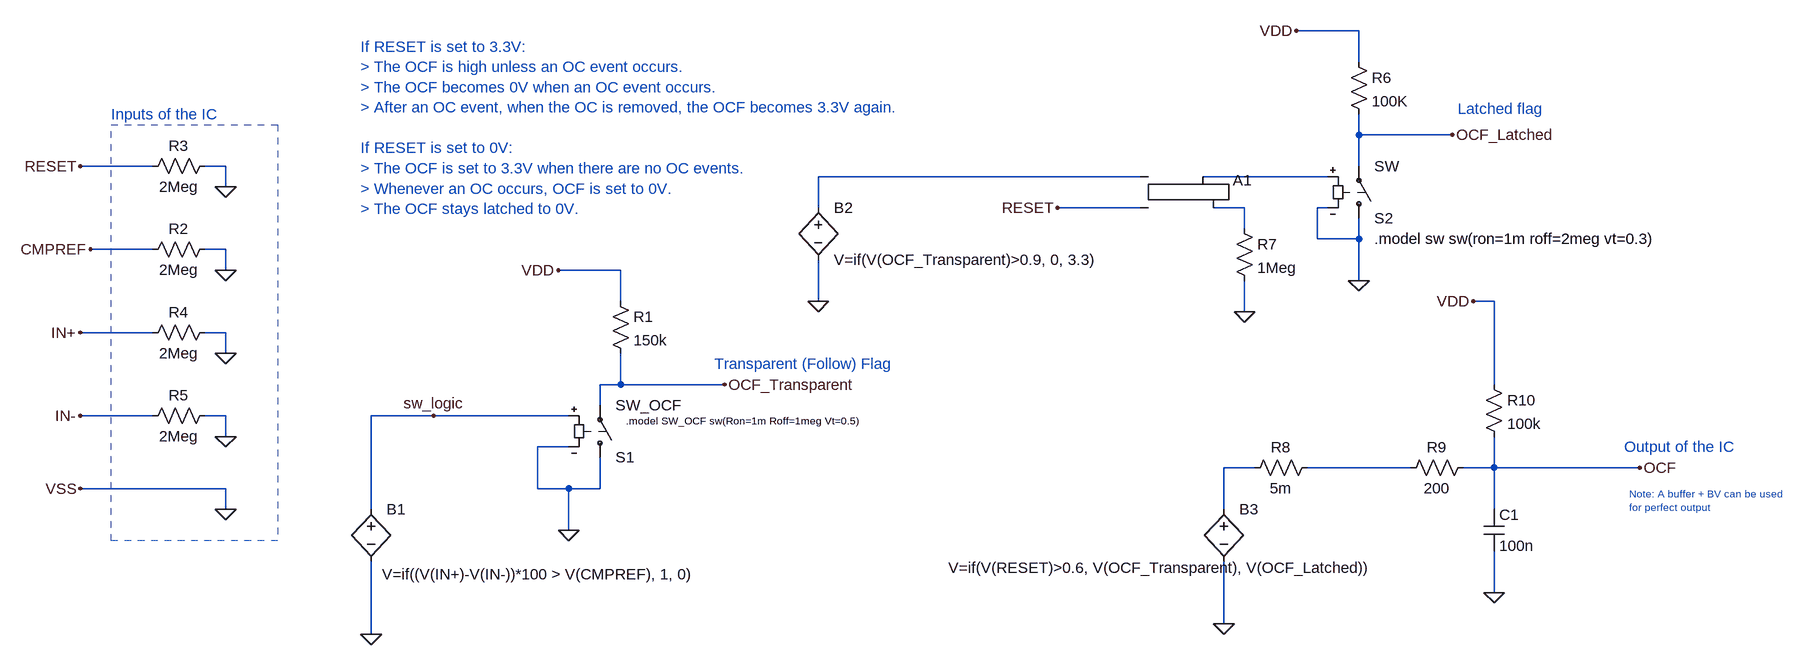
[diagram p0: schematic INA381A1.asc]
INA381A1.asc, the LTspice schematic file:
Version 4
SHEET 1 2812 680
WIRE 1392 -448 1296 -448
WIRE 1392 -400 1392 -448
WIRE 1392 -288 1392 -320
WIRE 1536 -288 1392 -288
WIRE -464 -240 -576 -240
WIRE -352 -240 -384 -240
WIRE 1392 -240 1392 -288
WIRE 1056 -224 560 -224
WIRE 1344 -224 1152 -224
WIRE -352 -208 -352 -240
WIRE 560 -176 560 -224
WIRE 1056 -176 928 -176
WIRE 1216 -176 1168 -176
WIRE 1344 -176 1328 -176
WIRE 1216 -144 1216 -176
WIRE 1328 -128 1328 -176
WIRE 1392 -128 1392 -160
WIRE 1392 -128 1328 -128
WIRE -464 -112 -560 -112
WIRE -352 -112 -384 -112
WIRE -352 -80 -352 -112
WIRE 256 -80 160 -80
WIRE 1392 -64 1392 -128
WIRE 256 -32 256 -80
WIRE 560 -32 560 -96
WIRE 1600 -32 1568 -32
WIRE 1216 -16 1216 -64
WIRE -464 16 -576 16
WIRE -352 16 -384 16
WIRE -352 48 -352 16
WIRE 256 96 256 48
WIRE 256 96 224 96
WIRE 416 96 256 96
WIRE 1600 96 1600 -32
WIRE 224 128 224 96
WIRE -464 144 -576 144
WIRE -352 144 -384 144
WIRE -32 144 -128 144
WIRE 176 144 -32 144
WIRE -352 176 -352 144
WIRE 176 192 128 192
WIRE 1232 224 1184 224
WIRE 1472 224 1312 224
WIRE 1600 224 1600 176
WIRE 1600 224 1552 224
WIRE 1824 224 1600 224
WIRE -352 256 -576 256
WIRE 128 256 128 192
WIRE 176 256 128 256
WIRE 224 256 224 208
WIRE 224 256 176 256
WIRE -352 288 -352 256
WIRE -128 288 -128 144
WIRE 1184 288 1184 224
WIRE 1600 288 1600 224
WIRE 176 320 176 256
WIRE 1600 416 1600 352
WIRE 1184 464 1184 368
WIRE -128 480 -128 368
FLAG 160 -80 VDD
FLAG -560 -112 CMPREF
FLAG -576 256 VSS
FLAG 416 96 OCF_Transparent
FLAG -576 16 IN+
FLAG -576 144 IN-
FLAG -128 480 0
FLAG -32 144 sw_logic
FLAG -352 -80 0
FLAG -352 288 0
FLAG -352 48 0
FLAG -352 176 0
FLAG -576 -240 RESET
FLAG -352 -208 0
FLAG 560 -32 0
FLAG 928 -176 RESET
FLAG 1392 -64 0
FLAG 1296 -448 VDD
FLAG 1536 -288 OCF_Latched
FLAG 1184 464 0
FLAG 1216 -16 0
FLAG 1600 416 0
FLAG 1568 -32 VDD
FLAG 1824 224 OCF
FLAG 176 320 0
SYMBOL sw 224 224 M180
SYMATTR InstName S1
SYMATTR Value SW_OCF
SYMBOL bv -128 272 R0
WINDOW 3 17 116 Left 2
SYMATTR Value V=if((V(IN+)-V(IN-))*100 > V(CMPREF), 1, 0)
SYMATTR InstName B1
SYMBOL res 240 -48 R0
SYMATTR InstName R1
SYMATTR Value 150k
SYMBOL res -368 -128 R90
WINDOW 0 0 56 VBottom 2
WINDOW 3 32 56 VTop 2
SYMATTR InstName R2
SYMATTR Value 2Meg
SYMBOL res -368 0 R90
WINDOW 0 0 56 VBottom 2
WINDOW 3 32 56 VTop 2
SYMATTR InstName R4
SYMATTR Value 2Meg
SYMBOL res -368 128 R90
WINDOW 0 0 56 VBottom 2
WINDOW 3 32 56 VTop 2
SYMATTR InstName R5
SYMATTR Value 2Meg
SYMBOL res -368 -256 R90
WINDOW 0 0 56 VBottom 2
WINDOW 3 32 56 VTop 2
SYMATTR InstName R3
SYMATTR Value 2Meg
SYMBOL bv 560 -192 R0
SYMATTR InstName B2
SYMATTR Value V=if(V(OCF_Transparent)>0.9, 0, 3.3)
SYMBOL Digital\\srflop 1104 -272 R0
SYMATTR InstName A1
SYMBOL sw 1392 -144 M180
SYMATTR InstName S2
SYMBOL res 1376 -416 R0
SYMATTR InstName R6
SYMATTR Value 100K
SYMBOL bv 1184 272 R0
WINDOW 3 -424 106 Left 2
SYMATTR Value V=if(V(RESET)>0.6, V(OCF_Transparent), V(OCF_Latched))
SYMATTR InstName B3
SYMBOL res 1200 -160 R0
SYMATTR InstName R7
SYMATTR Value 1Meg
SYMBOL res 1328 208 R90
WINDOW 0 0 56 VBottom 2
WINDOW 3 32 56 VTop 2
SYMATTR InstName R8
SYMATTR Value 5m
SYMBOL res 1568 208 R90
WINDOW 0 0 56 VBottom 2
WINDOW 3 32 56 VTop 2
SYMATTR InstName R9
SYMATTR Value 200
SYMBOL cap 1584 288 R0
SYMATTR InstName C1
SYMATTR Value 100n
SYMBOL res 1584 80 R0
SYMATTR InstName R10
SYMATTR Value 100k
TEXT 264 152 Left 1 !.model SW_OCF sw(Ron=1m Roff=1meg Vt=0.5)
TEXT -144 -424 Left 2 ;If RESET is set to 3.3V:\n> The OCF is high unless an OC event occurs.\n> The OCF becomes 0V when an OC event occurs.\n> After an OC event, when the OC is removed, the OCF becomes 3.3V again.\n \nIf RESET is set to 0V:\n> The OCF is set to 3.3V when there are no OC events.\n> Whenever an OC occurs, OCF is set to 0V.\n> The OCF stays latched to 0V.
TEXT 1416 -128 Left 2 !.model sw sw(ron=1m roff=2meg vt=0.3)
TEXT -528 -320 Left 2 ;Inputs of the IC
TEXT 1544 -328 Left 2 ;Latched flag
TEXT 400 64 Left 2 ;Transparent (Follow) Flag
TEXT 1800 192 Left 2 ;Output of the IC
TEXT 1808 264 Left 1 ;Note: A buffer + BV can be used \nfor perfect output
RECTANGLE Normal -272 336 -528 -304 2

The netlist it stands for:
* INA381A1.asc
S1 0 OCF_Transparent sw_logic 0 SW_OCF
B1 sw_logic 0 V=if((V(IN+)-V(IN-))*100 > V(CMPREF), 1, 0)
R1 VDD OCF_Transparent 150k
R2 0 CMPREF 2Meg
R4 0 IN+ 2Meg
R5 0 IN- 2Meg
R3 0 RESET 2Meg
B2 N001 0 V=if(V(OCF_Transparent)>0.9, 0, 3.3)
A1 N001 RESET 0 0 0 N003 N002 0 SRFLOP
S2 0 OCF_Latched N002 0 SW
R6 VDD OCF_Latched 100K
B3 N004 0 V=if(V(RESET)>0.6, V(OCF_Transparent), V(OCF_Latched))
R7 N003 0 1Meg
R8 N005 N004 5m
R9 OCF N005 200
C1 OCF 0 100n
R10 VDD OCF 100k
.model SW_OCF sw(Ron=1m Roff=1meg Vt=0.5)
* If RESET is set to 3.3V:
* > The OCF is high unless an OC event occurs.
* > The OCF becomes 0V when an OC event occurs.
* > After an OC event, when the OC is removed, the OCF becomes 3.3V again.
* If RESET is set to 0V:
* > The OCF is set to 3.3V when there are no OC events.
* > Whenever an OC occurs, OCF is set to 0V.
* > The OCF stays latched to 0V.
.model sw sw(ron=1m roff=2meg vt=0.3)
* Inputs of the IC
* Latched flag
* Transparent (Follow) Flag
* Output of the IC
* Note: A buffer + BV can be used
* for perfect output
.backanno
.end